# EasyEDA Pro project ProPrj_GTStoppuhr_v0.1.epro

# Schematic Schematic1
Board Name: Board1; Create Date: 2025-01-04; Page Name: P1; Project Name: GravitraxStoppuhr; Schematic Name: Schematic1; Update Date: 2025-01-04; Company: EasyEDA.com; Page Size: A4; Version: V1.0
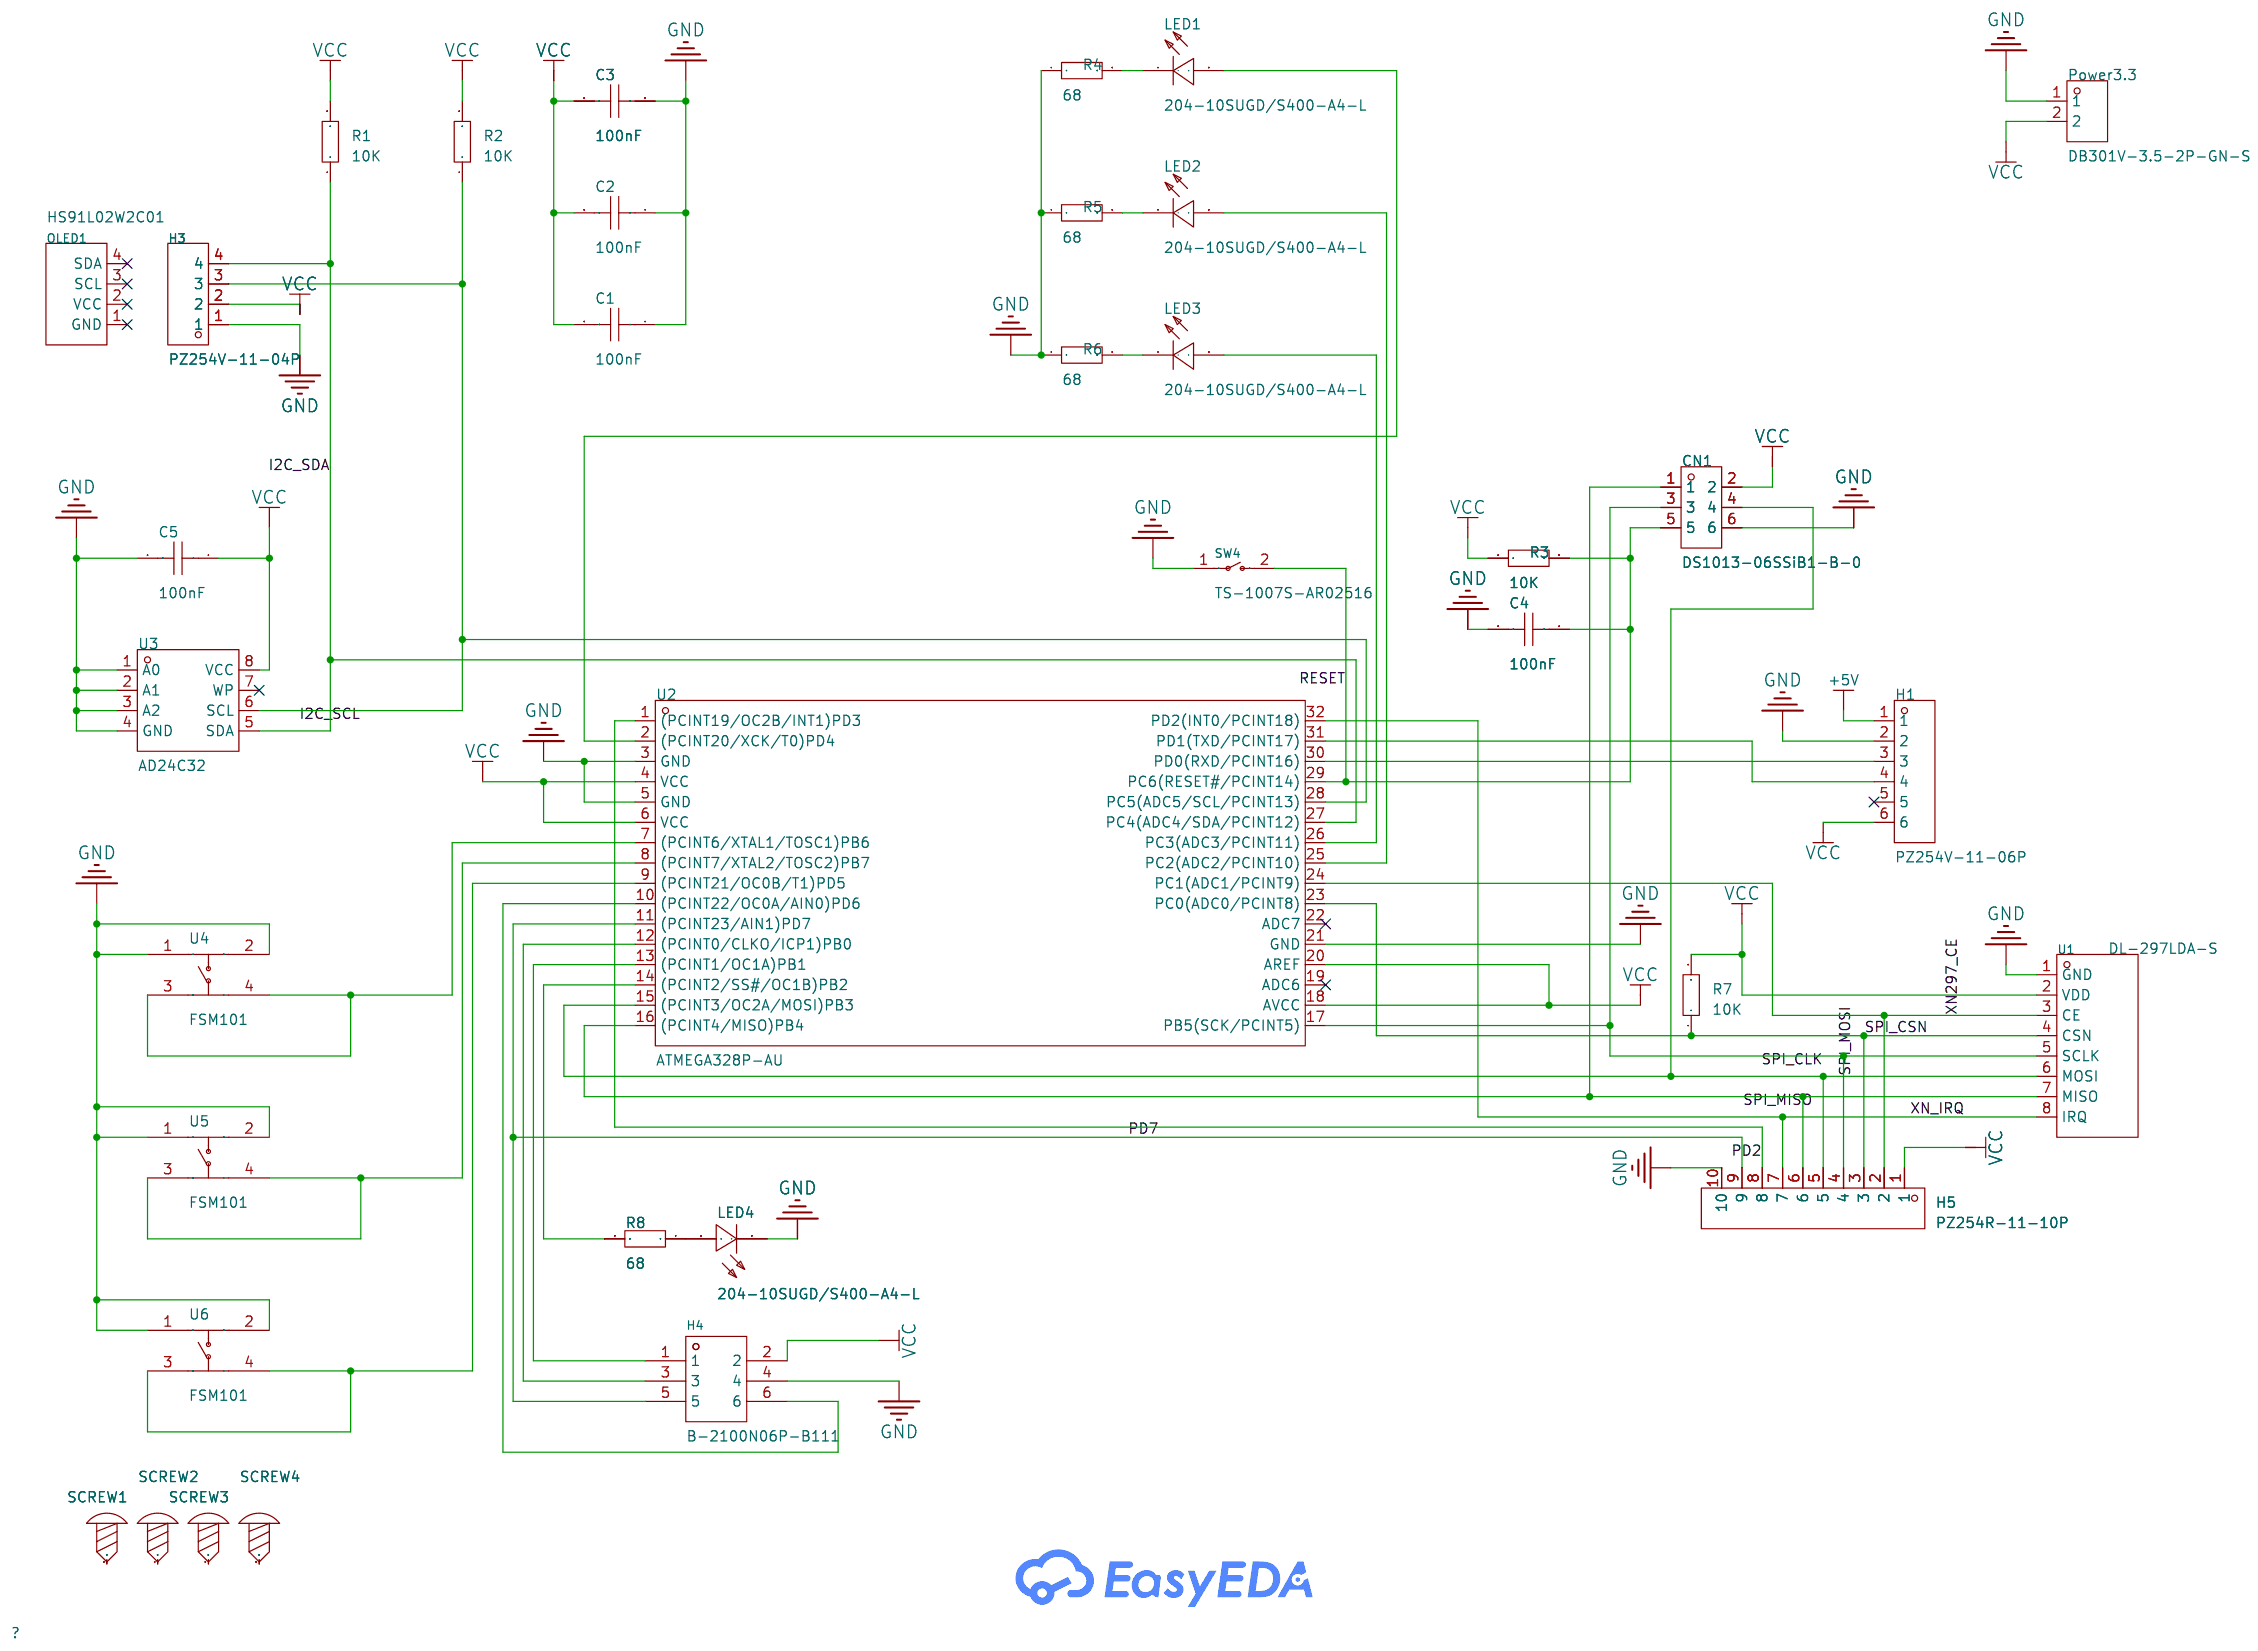
[diagram p0: schematic sheet]

## Parts
C1  100nF  [C0805]
C2  100nF  [C0805]
C3  100nF  [C0805]
C4  100nF  [C1206]
C5  100nF  [C0805]
CN1  DS1013-06SSiB1-B-0  [IDC-TH_6P-P2.54_DS1013-06SSIB1-B-0]
H1  PZ254V-11-06P  [HDR-TH_6P-P2.54-V-M]
H3  PZ254V-11-04P  [HDR-TH_4P-P2.54-V-M]
H4  B-2100N06P-B111  [HDR-SMD_6P-P2.54-V-M-R2-C3-S2.54-LS7.3]
H5  PZ254R-11-10P  [HDR-TH_10P-P2.54-H-M-W10.4]
LED1  204-10SUGD/S400-A4-L  [LED-TH_BD3.9-P2.54-RD]
LED2  204-10SUGD/S400-A4-L  [LED-TH_BD3.9-P2.54-RD]
LED3  204-10SUGD/S400-A4-L  [LED-TH_BD3.9-P2.54-RD]
LED4  204-10SUGD/S400-A4-L  [LED-TH_BD3.9-P2.54-RD]
OLED1  HS91L02W2C01  [OLED-TH_L38.0-W12.0_HS91L02W2C01]
Power3.3  DB301V-3.5-2P-GN-S  [CONN-TH_DB301V-3.5-2P-GN]
R1  10K  [R1206]
R2  10K  [R1206]
R3  10K  [R1206]
R4  68  [R1206]
R5  68  [R1206]
R6  68  [R1206]
R7  10K  [R1206]
R8  68  [R1206]
SCREW1  -  [Screw-Hole-M4]
SCREW2  -  [Screw-Hole-M4]
SCREW3  -  [Screw-Hole-M4]
SCREW4  -  [Screw-Hole-M4]
SW4  TS-1007S-AR02516  [SW-SMD_L6.1-W3.6-LS7.9]
U1  DL-297LDA-S  [WIRELM-SMD_DL-297LDA-S]
U2  ATMEGA328P-AU  [TQFP-32_L7.0-W7.0-P0.80-LS9.0-BL]
U3  AD24C32  [TSSOP-8_L4.4-W3.0-P0.65-LS6.4-BL-3]
U4  FSM101  [SW-TH_4P-L12.0-W12.0-P5.00-LS12.5]
U5  FSM101  [SW-TH_4P-L12.0-W12.0-P5.00-LS12.5]
U6  FSM101  [SW-TH_4P-L12.0-W12.0-P5.00-LS12.5]

## Library data of the parts
C1-C5 = CAP_0603: Supplier Footprint: 0603
CN1 = DS1013-06SSiB1-B-0: Connector Type:Simple cow constellation Pitch:2.54mm Structure:2x3P Holder Type:Direct Insert Number of Rows:2 Pin Number in each Row:3; LCSC Part Name: 2.54mm 2x3P 排数:2 每排P数:3; Supplier Part: C7430309; Manufacturer: CONNFLY; Supplier Footprint: 插件,P=2.54mm; JLCPCB Part Class: Extended Part; Datasheet: https://atta.szlcsc.com/upload/public/pdf/source/20240724/27F7346E828A07242999055B29F019B2.pdf; Supplier: LCSC; Connector Type: Simple cow constellation; Pitch: 2.54mm; Structure: 2x3P; Holder Type: Direct Insert; Number of Rows: 2; Pin Number in each Row: 3
H1 = PZ254V-11-06P: Pin Structure:1x6P Pitch:2.54mm Row Spacing:- Circluar Pins/Square Pins:Square Pins Mounting Type:Straight Number of Rows:Plugin Number of Pins:6P Current Rating (Max):- Voltage Rating (Max):- Length of Mating Pin:6mm Insulation Height:2.5mm Length of End; LCSC Part Name: 间距:2.54mm 1x6P 直插 方针; Supplier Part: C492405; Manufacturer: XFCN(兴飞); Supplier Footprint: 插件,P=2.54mm; JLCPCB Part Class: Extended Part; Datasheet: https://atta.szlcsc.com/upload/public/pdf/source/20200309/C492405_597F1930F5B55CC3C7FD95458F1C3977.pdf; Supplier: LCSC; Pin Structure: 1x6P; Pitch: 2.54mm; Circluar Pins/Square Pins: Square Pins; Mounting Type: Straight; Number of Rows: Plugin; Number of Pins: 6P; Length of Mating Pin: 6mm; Insulation Height: 2.5mm; Length of End Connection Pin: 3mm; Operating Temperature Range: -40℃~+105℃; Color: Black
H3 = PZ254V-11-04P: Pin Structure:1x4P Pitch:2.54mm Row Spacing:- Circluar Pins/Square Pins:Square Pins Mounting Type:Straight Number of Rows:Plugin Number of Pins:4P Current Rating (Max):3A Voltage Rating (Max):250V Length of Mating Pin:6mm Insulation Height:2.5mm Length of; LCSC Part Name: 间距:2.54mm 1x4P 直插 方针; Supplier Part: C2691448; Manufacturer: XFCN(兴飞); Supplier Footprint: 插件,P=2.54mm; JLCPCB Part Class: Extended Part; Datasheet: https://atta.szlcsc.com/upload/public/pdf/source/20200309/C492403_F9F19131791D08044AD4F84F8E751A34.pdf; Supplier: LCSC; Pin Structure: 1x4P; Pitch: 2.54mm; Circluar Pins/Square Pins: Square Pins; Mounting Type: Straight; Number of Rows: Plugin; Number of Pins: 4P; Current Rating (Max): 3A; Voltage Rating (Max): 250V; Length of Mating Pin: 6mm; Insulation Height: 2.5mm; Length of End Connection Pin: 3mm; Operating Temperature Range: -40℃~+105℃; Color: Black
H4 = B-2100N06P-B111: Pin Structure:2x3P Pitch:2.54mm Row Spacing:2.54mm Circluar Pins/Square Pins:Square Pins Mounting Type:Brick nogging Number of Rows:双排 Number of Pins:6P Current Rating (Max):- Voltage Rating (Max):- Length of Mating Pin:6mm Insulation Height:2mm Length of; LCSC Part Name: 间距:2.54mm 2x3P 立贴 方针; Supplier Part: C124390; Manufacturer: Ckmtw(灿科盟); Supplier Footprint: SMD,P=2.54mm; JLCPCB Part Class: Extended Part; Datasheet: https://atta.szlcsc.com/upload/public/pdf/source/20170821/C124391_1503303314915901545.pdf; Supplier: LCSC; Pin Structure: 2x3P; Pitch: 2.54mm; Row Spacing: 2.54mm; Circluar Pins/Square Pins: Square Pins; Mounting Type: Brick nogging; Number of Rows: 双排; Number of Pins: 6P; Length of Mating Pin: 6mm; Insulation Height: 2mm; Operating Temperature Range: -40℃~+105℃; Color: Black
H5 = PZ254R-11-10P: Pin Structure:1x10P Pitch:2.54mm Row Spacing:- Circluar Pins/Square Pins:Square Pins Mounting Type:Right-Angle Number of Rows:Plugin Number of Pins:10P Current Rating (Max):- Voltage Rating (Max):- Length of Mating Pin:6mm Insulation Height:2.5mm Contact; LCSC Part Name: 间距:2.54mm 1x10P 弯插 方针; Supplier Part: C492418; Manufacturer: XFCN(兴飞); Supplier Footprint: 弯插,P=2.54mm; JLCPCB Part Class: Extended Part; Datasheet: https://atta.szlcsc.com/upload/public/pdf/source/20200309/C492418_7D4B377DA52397FDD3F1E8B8860933B9.pdf; Supplier: LCSC; Pin Structure: 1x10P; Pitch: 2.54mm; Circluar Pins/Square Pins: Square Pins; Mounting Type: Right-Angle; Number of Rows: Plugin; Number of Pins: 10P; Length of Mating Pin: 6mm; Insulation Height: 2.5mm; Operating Temperature Range: -40℃~+105℃; Color: Black
LED1-LED4 = 204-10SUGD/S400-A4-L: Supplier Part: C778892; Manufacturer: EVERLIGHT(亿光); Supplier Footprint: 插件; JLCPCB Part Class: Extended Part; Supplier: LCSC
OLED1 = HS91L02W2C01: Main Control Chip:SSD1306 Interface Type:I2C Size:0.91 Pixel Resolution:128x32 Operating Temperature:-40℃~+70℃ Operating Temperature:-40℃~+70℃; LCSC Part Name: 0.91寸OLED显示屏白光IIC; Supplier Part: C5248081; Manufacturer: HS(汉昇); JLCPCB Part Class: Extended Part; Datasheet: https://atta.szlcsc.com/upload/public/pdf/source/20230727/C3E43C8E3DDA847F5681FEE7D95C153D.pdf; Supplier: LCSC; Main Control Chip: SSD1306; Interface Type: I2C; Size: 0.91; Pixel Resolution: 128x32; Operating Temperature: -40℃~+70℃
Power3.3 = DB301V-3.5-2P-GN-S: Structure:1x2P Pitch:3.5mm Color:Green Mounting Style:Straight Current Rating (Max):10A Voltage Rating (Max):130V Number of Pins:2P Number of Rows:1 Wire Gauge - AWG:18~24 Wire Gauge - AWG:18~24 Wire Gauge - mm2:0.5~1 Wire Gauge - mm2:0.5~1 Number of PINs; LCSC Part Name: 3.5mm 1x2P 排数:1 每排P数:2 直插; Supplier Part: C695629; Manufacturer: DORABO(地博电气); Supplier Footprint: 插件,P=3.5mm; JLCPCB Part Class: Extended Part; Datasheet: https://atta.szlcsc.com/upload/public/pdf/source/20230106/1B95616A85A883CA085E21635C8A8490.pdf; Supplier: LCSC; Structure: 1x2P; Pitch: 3.5mm; Color: Green; Mounting Style: Straight; Current Rating (Max): 10A; Voltage Rating (Max): 130V; Number of Pins: 2P; Number of Rows: 1; Wire Gauge - AWG: 18~24; Wire Gauge - mm2: 0.5~1; Number of PINs Per Row: 2; Operating Temperature Range: -40℃~+105℃
R1-R8 = Res_0603: Supplier Footprint: 0603
SCREW1-SCREW4 = Screw-Hole-M4: Supplier Footprint: 插件
SW4 = TS-1007S-AR02516: Circuit:SPST Actuator Style:Rectangle button Operating Force:160gf Mounting Style:Brick nogging Switch Length:6.1mm Switch Width:3.7mm Switch Height:2.5mm Strike Gundam:不带 Contact Current:50mA Voltage Rating (DC):12V Insulation Resistance:100MΩ Actuator/C; LCSC Part Name: 6.1*3.7*2.5mm 立贴 轻触开关; Supplier Part: C720381; Manufacturer: XUNPU(讯普); Supplier Footprint: SMD; JLCPCB Part Class: Extended Part; Datasheet: https://atta.szlcsc.com/upload/public/pdf/source/20200812/C720381_7D5C1A68D18F0196EF37FF8AC1146778.pdf; Supplier: LCSC; Circuit: SPST; Actuator Style: Rectangle button; Operating Force: 160gf; Mounting Style: Brick nogging; Switch Length: 6.1mm; Switch Width: 3.7mm; Switch Height: 2.5mm; Strike Gundam: 不带; Contact Current: 50mA; Voltage Rating (DC): 12V; Insulation Resistance: 100MΩ; Actuator/Cap Color: Gray; Pin Style: Gull Wing; Mechanical Life: 5万次; Operating Temperature: -30℃~+80℃
U1 = DL-297LDA-S: LCSC Part Name: 2.4g模块无线模块接收发射; Supplier Part: C2837201; Manufacturer: DreamLNK(骏晔科技); Supplier Footprint: SMD; JLCPCB Part Class: Extended Part; Datasheet: https://atta.szlcsc.com/upload/public/pdf/source/20210617/C2837201_570735521B38E6A2F19BE7521136B45C.pdf; Supplier: LCSC
U2 = ATMEGA328P-AU_C14877: CPU Core:AVR Program Storage Size:32KB RAM Size:2KB GPIO Ports Number:23 Operating Voltage Range:1.8V~5.5V Operating Voltage Range:1.8V~5.5V CPU Maximum Speed:20MHz Program Memory Type:FLASH EEPROM:1KB Operating Temperature Range:-40℃~+85℃ Operating Tempe; LCSC Part Name: 基于AVR增强型RISC架构的低功耗CMOS 8位微控制器; Supplier Part: C14877; Manufacturer: MICROCHIP(美国微芯); Supplier Footprint: TQFP-32(7x7); JLCPCB Part Class: Extended Part; Datasheet: https://atta.szlcsc.com/upload/public/pdf/source/20140621/1457707095197.pdf; Supplier: LCSC; CPU Core: AVR; Program Storage Size: 32KB; RAM Size: 2KB; GPIO Ports Number: 23; Operating Voltage Range: 1.8V~5.5V; CPU Maximum Speed: 20MHz; Program Memory Type: FLASH; EEPROM: 1KB; Operating Temperature Range: -40℃~+85℃; ADC (Bit): 10bit; Peripheral/Function: WDT；PWM；WDT；PWM; Watchdog: 有; Low-Voltage Detect: 有; Internal Oscillator: 有
U3 = AD24C32: LCSC Part Name: AD24C32串行电可擦除编程只读存储器; Supplier Part: C5125084; Manufacturer: IDCHIP(英锐芯); Supplier Footprint: SOP-8; JLCPCB Part Class: Extended Part; Datasheet: https://atta.szlcsc.com/upload/public/pdf/source/20220829/6CBBEA77791E2F8788A705B689BDBCE3.pdf; Supplier: LCSC
U4-U6 = FSM101: Circuit:SPST - normally open Actuator Style:Round Button Operating Force:160gf Mounting Style:Direct Insert Contact Current:50mA Voltage Rating (DC):24V Pin Style:PCPin Operating Temperature:-35℃~+85℃ Operating Temperature:-35℃~+85℃; Supplier Part: C5340381; Manufacturer: TE Connectivity(泰科电子); Supplier Footprint: DIP,12x12mm; JLCPCB Part Class: Extended Part; Datasheet: https://atta.szlcsc.com/upload/public/pdf/source/20210514/C592923_B94202CB5993ABE6D458CA03B488B113.pdf; Supplier: LCSC; Circuit: SPST - normally open; Actuator Style: Round Button; Operating Force: 160gf; Mounting Style: Direct Insert; Contact Current: 50mA; Voltage Rating (DC): 24V; Pin Style: PCPin; Operating Temperature: -35℃~+85℃

## Nets
+5V: H1.1
GND: C1.1 C2.1 C3.2 C4.2 C5.2 CN1.6 H1.2 H3.1 H4.4 H5.10 LED4.1(-) Power3.3.1 R4.1 R5.1 R6.1 SW4.1 U1.1(GND) U2.3(GND) U2.5(GND) U2.21(GND) U3.1(A0) U3.2(A1) U3.3(A2) U3.4(GND) U4.1 U4.2 U5.1 U5.2 U6.1 U6.2
VCC: C1.2 C2.2 C3.1 C5.1 CN1.2 H1.6 H3.2 H4.2 H5.1 Power3.3.2 R1.2 R2.2 R3.1 R7.2 U1.2(VDD) U2.4(VCC) U2.6(VCC) U2.18(AVCC) U2.20(AREF) U3.8(VCC)
I2C_SCL: H3.3 R2.1 U2.28(PC5(ADC5/SCL/PCINT13)) U3.6(SCL)
I2C_SDA: H3.4 R1.1 U2.27(PC4(ADC4/SDA/PCINT12)) U3.5(SDA)
PD2: H5.8 U2.1((PCINT19/OC2B/INT1)PD3)
PD7: H4.5 H5.9 U2.11((PCINT23/AIN1)PD7)
RESET: C4.1 CN1.5 R3.2 SW4.2 U2.29(PC6(RESET#/PCINT14))
SPI_CLK: CN1.3 H5.4 U1.5(SCLK) U2.17(PB5(SCK/PCINT5))
SPI_CSN: H5.3 R7.1 U1.4(CSN) U2.23(PC0(ADC0/PCINT8))
SPI_MISO: CN1.1 H5.6 U1.7(MISO) U2.16((PCINT4/MISO)PB4)
SPI_MOSI: CN1.4 H5.5 U1.6(MOSI) U2.15((PCINT3/OC2A/MOSI)PB3)
XN297_CE: H5.2 U1.3(CE) U2.24(PC1(ADC1/PCINT9))
XN_IRQ: H5.7 U1.8(IRQ) U2.32(PD2(INT0/PCINT18))
$1N1844: H1.3 U2.30(PD0(RXD/PCINT16))
$1N1848: H1.4 U2.31(PD1(TXD/PCINT17))
$1N2906: LED1.1(-) R4.2
$1N2910: LED2.1(-) R5.2
$1N2915: LED3.1(-) R6.2
$1N3481: LED3.2(+) U2.26(PC3(ADC3/PCINT11))
$1N3487: LED2.2(+) U2.25(PC2(ADC2/PCINT10))
$1N3494: LED1.2(+) U2.2((PCINT20/XCK/T0)PD4)
$1N3868: U2.7((PCINT6/XTAL1/TOSC1)PB6) U4.3 U4.4
$1N3892: U2.8((PCINT7/XTAL2/TOSC2)PB7) U5.3 U5.4
$1N3898: U2.9((PCINT21/OC0B/T1)PD5) U6.3 U6.4
$1N3977: LED4.2(+) R8.1
$1N4659: H4.3 U2.12((PCINT0/CLKO/ICP1)PB0)
$1N4673: H4.6 U2.10((PCINT22/OC0A/AIN0)PD6)
$1N4779: R8.2 U2.14((PCINT2/SS#/OC1B)PB2)
$1N5708: H4.1 U2.13((PCINT1/OC1A)PB1)

Not connected (* = marked no-connect by the designer): H1 5*; OLED1 1(GND)* 2(VCC)* 3(SCL)* 4(SDA)*; SCREW1 1; SCREW2 1; SCREW3 1; SCREW4 1; U2 19(ADC6)* 22(ADC7)*; U3 7(WP)*

# Board PCB1
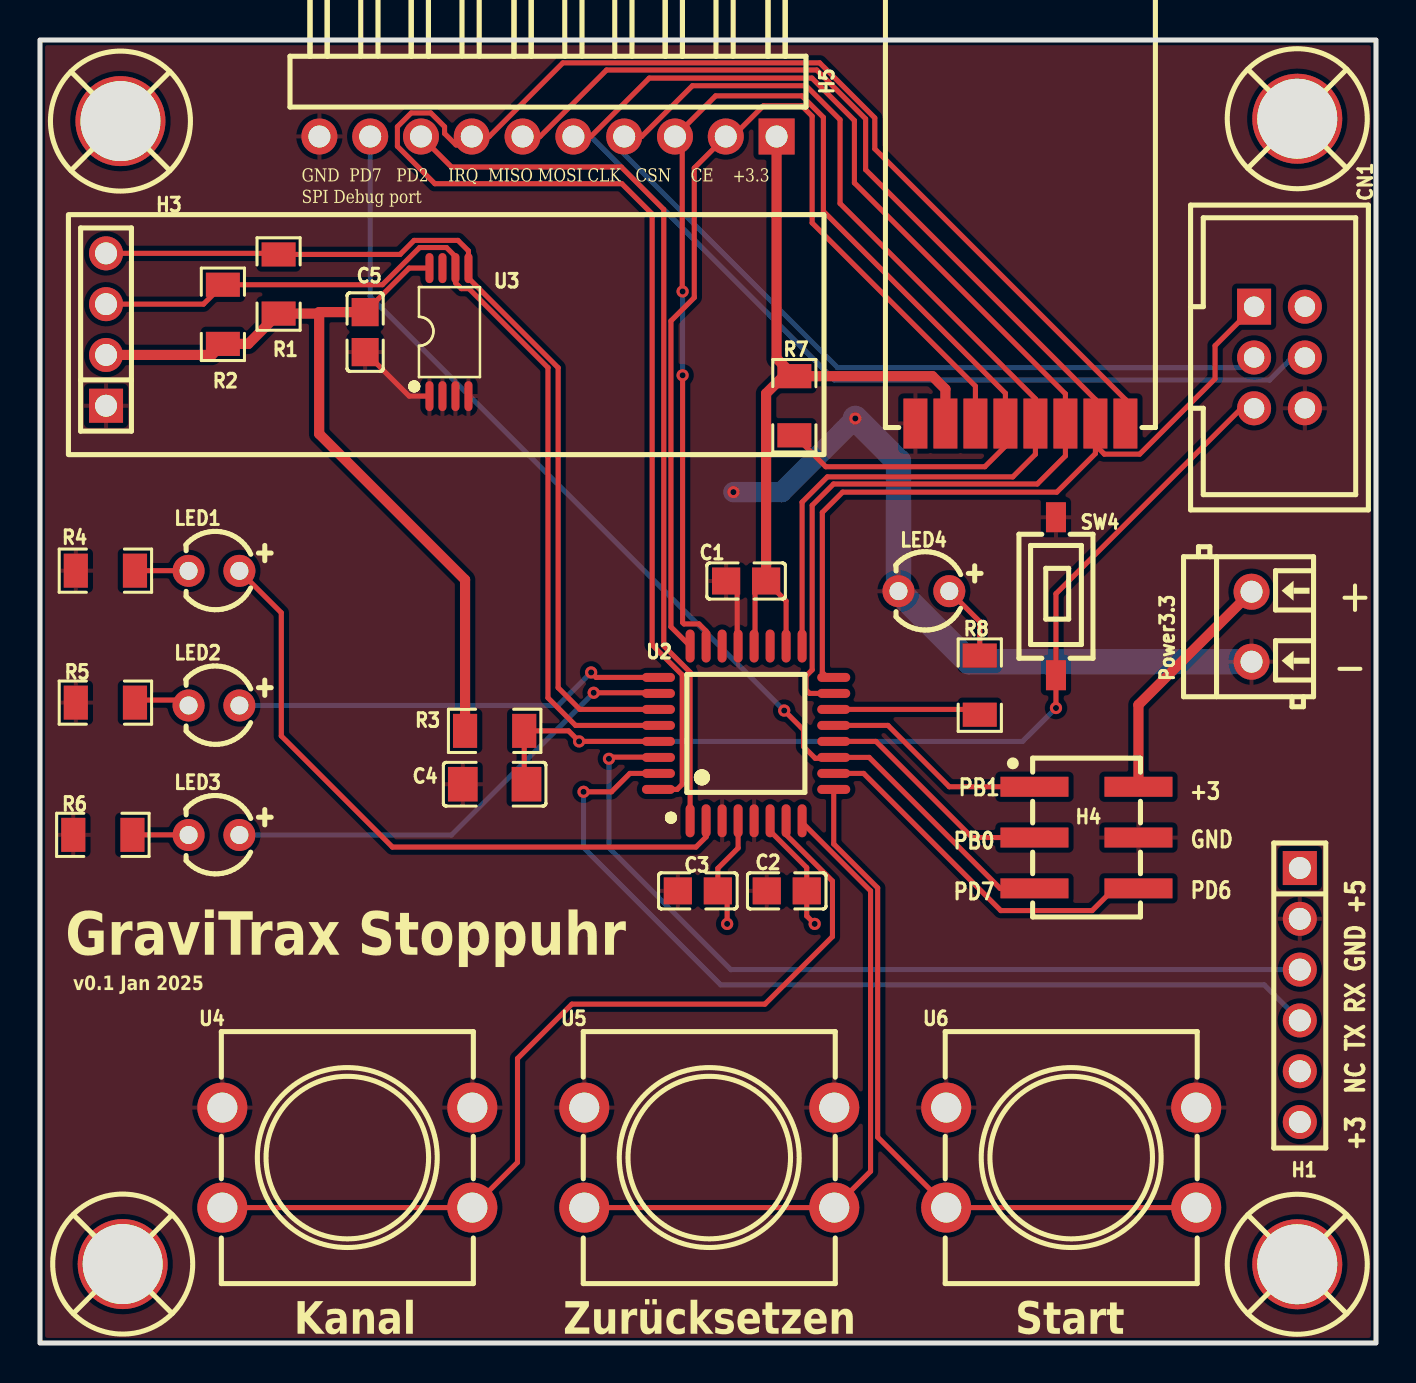
[diagram p1: board, top side]
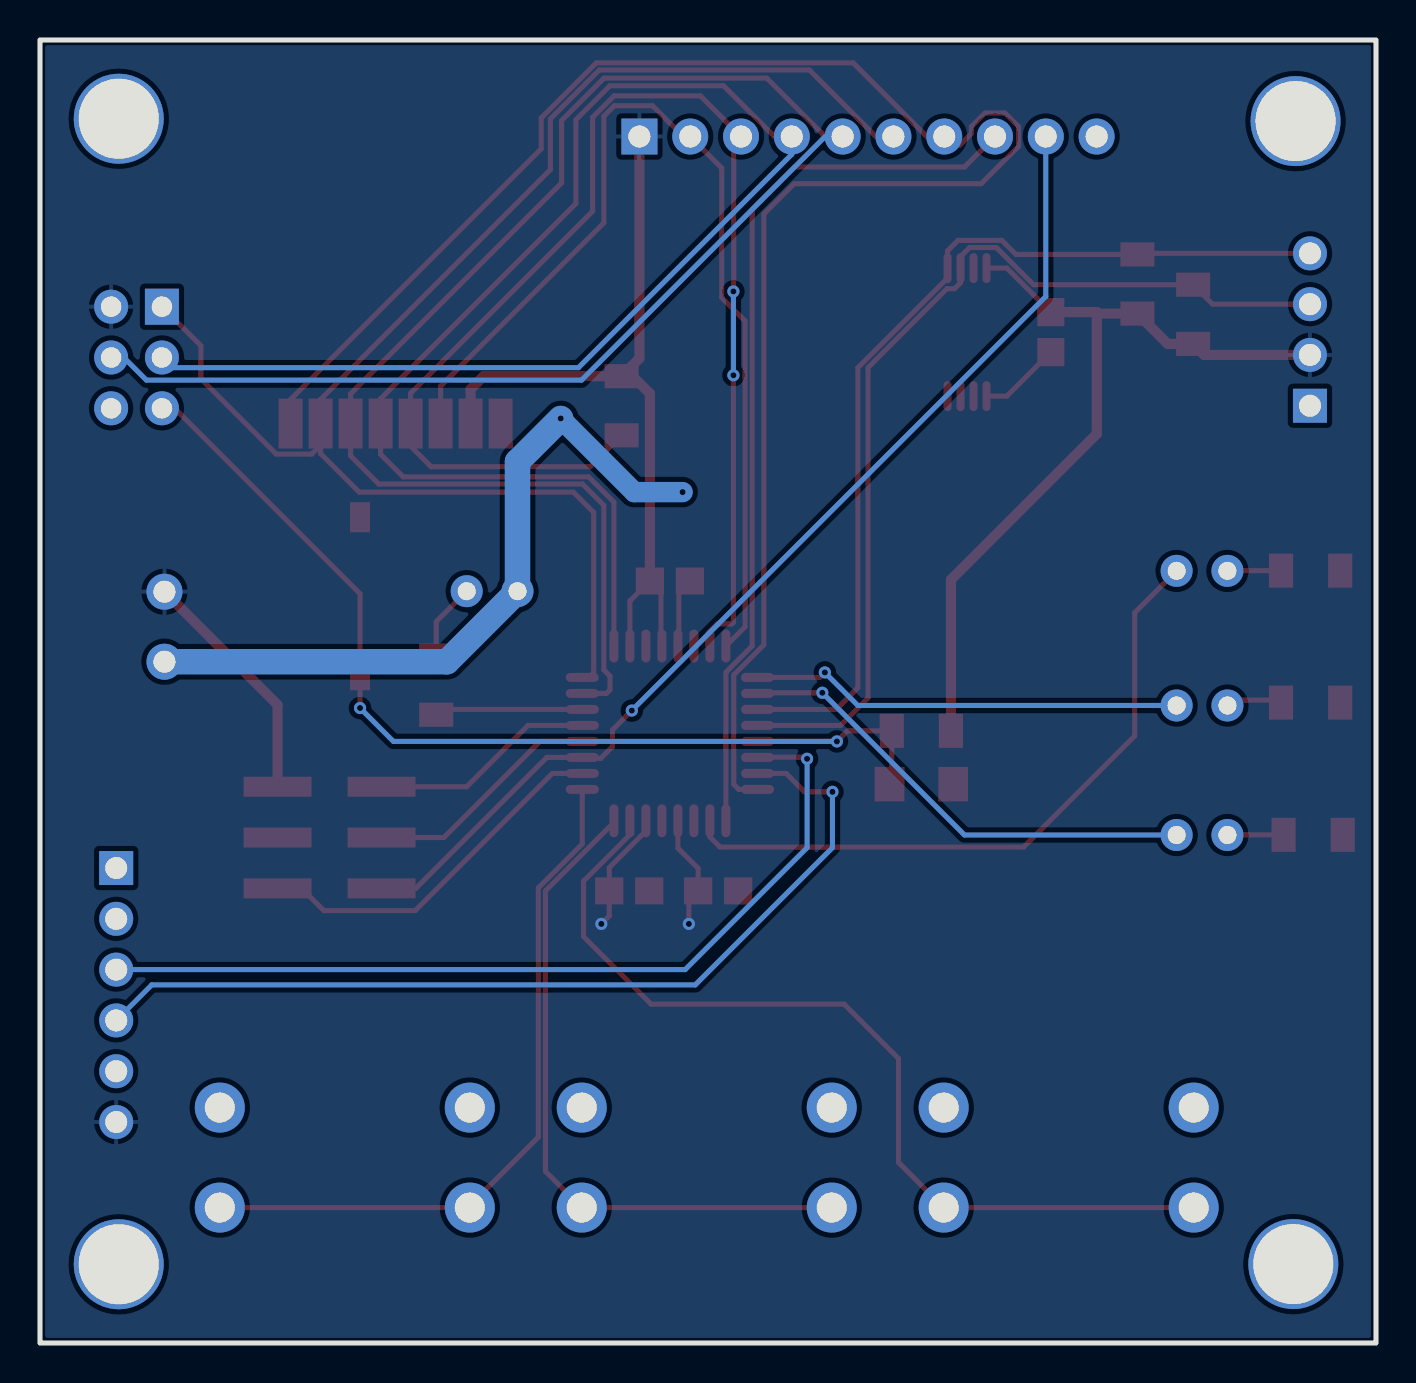
[diagram p2: board, bottom side, seen from below]

Outline 66.8 x 65.15 mm; copper layers: Top Layer, Bottom Layer. Coordinates in mm from the lower left corner of the outline.
Outline path: rectangle 0,65.15 66.8,0
Stack: Top Layer 0.035mm / Dielectric1 1.51mm FR4 er 4.5 / Bottom Layer 0.035mm

## Design rules (mm)
template: JLCPCB Capability(Two Layers Board)
spacing copperThickness1oz (default): track to track 0.102, other pairs 0.152 to 0.3
spacing copperThickness2oz: track to track 0.203, other pairs 0.152 to 0.3
track width copperThickness1oz (default): min 0.127, default 0.254, max 2.54
track width copperThickness2oz: min 0.203, default 0.254, max 2.54
differential pair differentialPair (default): width min 0.127, default 0.254, max 2.54; gap min 0.152, default 0.152
via viaSize (default): diameter min 0.5, default 0.61, max 10; hole min 0.3, default 0.305, max 6.3

## Placement (name value [footprint] x y rotation side)
C1  100nF  [C0805]  35.31 38.1 0 top
C2  100nF  [C0805]  37.34 22.61 0 top
C3  100nF  [C0805]  32.89 22.61 180 top
C4  100nF  [C1206]  22.73 27.94 180 top
C5  100nF  [C0805]  16.26 50.55 270 top
CN1  DS1013-06SSiB1-B-0  [IDC-TH_6P-P2.54_DS1013-06SSIB1-B-0]  61.98 49.28 270 top
H1  PZ254V-11-06P  [HDR-TH_6P-P2.54-V-M]  62.99 17.4 270 top
H3  PZ254V-11-04P  [HDR-TH_4P-P2.54-V-M]  3.3 50.67 90 top
H4  B-2100N06P-B111  [HDR-SMD_6P-P2.54-V-M-R2-C3-S2.54-LS7.3]  52.32 25.27 270 top
H5  PZ254R-11-10P  [HDR-TH_10P-P2.54-H-M-W10.4]  25.4 60.33 180 top
LED1  204-10SUGD/S400-A4-L  [LED-TH_BD3.9-P2.54-RD]  8.7 38.61 0 top
LED2  204-10SUGD/S400-A4-L  [LED-TH_BD3.9-P2.54-RD]  8.7 31.88 0 top
LED3  204-10SUGD/S400-A4-L  [LED-TH_BD3.9-P2.54-RD]  8.7 25.4 0 top
LED4  204-10SUGD/S400-A4-L  [LED-TH_BD3.9-P2.54-RD]  44.2 37.59 0 top
Power3.3  DB301V-3.5-2P-GN-S  [CONN-TH_DB301V-3.5-2P-GN]  60.58 35.81 90 top
R1  10K  [R1206]  11.93 52.95 270 top
R2  10K  [R1206]  9.14 51.44 270 top
R3  10K  [R1206]  22.73 30.61 0 top
R4  68  [R1206]  3.27 38.62 0 top
R5  68  [R1206]  3.27 32.02 0 top
R6  68  [R1206]  3.14 25.41 0 top
R7  10K  [R1206]  37.72 46.86 90 top
R8  68  [R1206]  46.99 32.89 270 top
SCREW1  -  [Screw-Hole-M4]  4.13 3.95 0 top
SCREW2  -  [Screw-Hole-M4]  62.86 3.94 0 top
SCREW3  -  [Screw-Hole-M4]  4.02 61.1 0 top
SCREW4  -  [Screw-Hole-M4]  62.86 61.21 0 top
SW4  TS-1007S-AR02516  [SW-SMD_L6.1-W3.6-LS7.9]  50.8 37.34 270 top
U1  DL-297LDA-S  [WIRELM-SMD_DL-297LDA-S]  49.02 45.97 0 top
U2  ATMEGA328P-AU  [TQFP-32_L7.0-W7.0-P0.80-LS9.0-BL]  35.31 30.48 0 top
U3  AD24C32  [TSSOP-8_L4.4-W3.0-P0.65-LS6.4-BL-3]  20.45 50.55 0 top
U4  FSM101  [SW-TH_4P-L12.0-W12.0-P5.00-LS12.5]  15.37 9.27 0 top
U5  FSM101  [SW-TH_4P-L12.0-W12.0-P5.00-LS12.5]  33.46 9.27 0 top
U6  FSM101  [SW-TH_4P-L12.0-W12.0-P5.00-LS12.5]  51.56 9.27 0 top

## Footprints (pads in the part's own frame, mm; a bottom-side part is the same pattern mirrored in y, then rotated)
C0805
  rect 1.41x1.35 smd: 1(-1,0) 2(1,0)
C1206
  rect 1.485x1.728 smd: 1(-1.593,0) 2(1.593,0)
CONN-TH_DB301V-3.5-2P-GN
  round 1.8 hole 1.1: 1(-1.75,0) 2(1.75,0)
HDR-SMD_6P-P2.54-V-M-R2-C3-S2.54-LS7.3
  rect 1x3.4 smd: 1(-2.54,-2.6) 2(-2.54,2.6) 3(0,-2.6) 4(0,2.6) 5(2.54,-2.6) 6(2.54,2.6)
HDR-TH_4P-P2.54-V-M
  rect 1.7x1.7 hole 1.1: 1(-3.81,0)
  round 1.7 hole 1.1: 2(-1.27,0) 3(1.27,0) 4(3.81,0)
HDR-TH_6P-P2.54-V-M
  rect 1.7x1.7 hole 1.1: 1(-6.35,0)
  round 1.7 hole 1.1: 2(-3.81,0) 3(-1.27,0) 4(1.27,0) 5(3.81,0) 6(6.35,0)
HDR-TH_10P-P2.54-H-M-W10.4
  rect 1.8x1.8 hole 1.1: 1(-11.43,0)
  round 1.8 hole 1.1: 2(-8.89,0) 3(-6.35,0) 4(-3.81,0) 5(-1.27,0) 6(1.27,0) 7(3.81,0) 8(6.35,0) 9(8.89,0) 10(11.43,0)
IDC-TH_6P-P2.54_DS1013-06SSIB1-B-0
  rect 1.8x1.7 hole 1.02: 1(-2.54,-1.27)
  round 1.7 hole 1.02: 2(-2.54,1.27) 3(0,-1.27) 4(0,1.27) 5(2.54,-1.27) 6(2.54,1.27)
LED-TH_BD3.9-P2.54-RD
  round 1.6 hole 0.9: 1(-1.27,0) 2(1.27,0)
R1206
  rect 1.208x1.701 smd: 1(-1.479,0) 2(1.479,0)
Screw-Hole-M4
  round 4.5 hole 4: 1(0,0)
SW-SMD_L6.1-W3.6-LS7.9
  rect 1.5x1 smd: 1(-3.95,0) 2(3.95,0)
SW-TH_4P-L12.0-W12.0-P5.00-LS12.5
  round 2.5 hole 1.5: 1(-6.25,2.5) 2(6.25,2.5) 3(-6.25,-2.5) 4(6.25,-2.5)
TQFP-32_L7.0-W7.0-P0.80-LS9.0-BL
  oval 0.45x1.65 smd: 1(-2.8,-4.369) 2(-2,-4.369) 3(-1.2,-4.369) 4(-0.4,-4.369) 5(0.4,-4.369) 6(1.2,-4.369) 7(2,-4.369) 8(2.8,-4.369) 17(2.8,4.369) 18(2,4.369) 19(1.2,4.369) 20(0.4,4.369) 21(-0.4,4.369) 22(-1.2,4.369) 23(-2,4.369) 24(-2.8,4.369)
  oval 1.65x0.45 smd: 9(4.381,-2.8) 10(4.381,-2) 11(4.381,-1.2) 12(4.381,-0.4) 13(4.381,0.4) 14(4.381,1.2) 15(4.381,2) 16(4.381,2.8) 25(-4.381,2.8) 26(-4.381,2) 27(-4.381,1.2) 28(-4.381,0.4) 29(-4.381,-0.4) 30(-4.381,-1.2) 31(-4.381,-2) 32(-4.381,-2.8)
TSSOP-8_L4.4-W3.0-P0.65-LS6.4-BL-3
  oval 0.4x1.5 smd: 1(-0.975,-3.2) 2(-0.325,-3.2) 3(0.325,-3.2) 4(0.976,-3.2) 5(0.976,3.2) 6(0.325,3.2) 7(-0.325,3.2) 8(-0.975,3.2)
WIRELM-SMD_DL-297LDA-S
  rect 1.2x2.5 smd: 1(-5.25,0) 2(-3.75,0) 3(-2.25,0) 4(-0.75,0) 5(0.75,0) 6(2.25,0) 7(3.75,0) 8(5.25,0)

## Nets
As in the schematic.

Pads without a net: H1 5; SCREW1 1; SCREW2 1; SCREW3 1; SCREW4 1; U2 19 22; U3 7

## Via types
v1: diameter 0.61, hole 0.305, Top Layer to Bottom Layer, 13 vias

## Routing (per net, layer and track width the routed paths; a pad name or vN(x,y) marks a point on that pad's centre or on a via; arc(x,y) is an arc through that point)
GND: length 43.8
  Top Layer w0.254: 34.61,38.1 34.86,37.85 34.86,34.89 U2.21 ; C5.2 18.46,47.35 U3.1
  Bottom Layer w1.016: v1(40.77,46.23) 37.08,42.55 v1(34.67,42.55)
  Bottom Layer w1.27: Power3.3.1 46.45,34.06 42.93,37.59 42.93,44.07 v1(40.77,46.23)
VCC: length 105.4
  Top Layer w0.254: U2.18 37.31,37.1 C1.2 ; U2.6 36.51,25.6 38.34,23.77 C2.2 38.34,21.35 v1(38.73,20.95) ; C5.1 18.46,53.75 U3.8 ; 35.75,37.85 35.75,34.89 U2.20 ; v1(34.36,20.95) 34.36,22.14 C3.1 33.89,23.73 34.91,24.75 U2.4
  Top Layer w0.508: 37.45,48.62 R7.2 44.62,48.34 45.27,47.69 U1.2 ; 37.45,48.62 36.31,47.48 C1.2 ; 37.45,48.62 36.83,49.23 H5.1 ; 13.96,51.47 R1.2 10.41,49.96 R2.2 8.59,49.4 H3.2 ; 13.96,51.47 13.96,45.46 21.25,38.16 21.25,30.61 ; 13.96,51.47 13.96,51.55 C5.1 ; H4.2 54.92,31.91 Power3.3.2
I2C_SCL: length 49.2
  Top Layer w0.254: H3.3 8.17,51.94 R2.1 17.12,52.91 18.98,54.78 20.32,54.78 20.83,54.27 20.83,53.8 U3.6 20.77,53.01 21.07,52.72 21.45,52.72 25.4,48.77 25.4,32.26 26.78,30.88 U2.28
I2C_SDA: length 47.8
  Top Layer w0.254: U2.27 26.99,31.68 25.91,32.77 25.91,48.76 21.42,53.25 U3.5 21.42,54.61 20.9,55.13 18.71,55.13 18,54.43 R1.1 11.88,54.48 H3.4
PD2: length 44.8
  Top Layer w0.254: U2.1 32.51,33.54 31.19,34.85 31.19,56.68 29.07,58.8 20.57,58.8 H5.8
PD7: length 54
  Top Layer w0.254: v1(37.21,31.62) 38.18,30.66 38.18,29.82 38.76,29.23 39.64,29.23 U2.11 41.46,29.28 48.01,22.73 H4.5
  Bottom Layer w0.254: 16.51,60.33 16.51,52.32 v1(37.21,31.62)
RESET: length 53.6
  Top Layer w0.254: v1(50.8,31.75) SW4.2 50.8,37.47 60.07,46.74 60.71,46.74 ; U2.29 v1(26.96,30.08) 26.43,30.61 R3.2 24.21,28.05 C4.1
  Bottom Layer w0.254: v1(26.96,30.08) 49.13,30.08 v1(50.8,31.75)
SPI_CLK: length 90.2
  Top Layer w0.254: U2.17 38.11,42.04 39.37,43.31 48.64,43.31 49.77,44.44 U1.5 49.77,47.21 40,56.98 40,61.16 38.3,62.87 32.62,62.87 30.08,60.33 H5.4
  Bottom Layer w0.254: H5.4 29.21,59.44 39.88,48.77 60.2,48.77 60.71,49.28
SPI_CSN: length 67.1
  Top Layer w0.254: R7.1 39.29,43.81 47.24,43.81 48.27,44.84 U1.4 48.27,47.49 39.17,56.59 39.17,61.28 38.1,62.36 33.78,62.36 H5.3 32.11,59.96 32.11,52.6 v1(32.13,52.58) ; v1(32.13,48.39) 32.13,36.02 32.2,35.95 32.95,35.95 33.31,35.6 U2.23
  Bottom Layer w0.254: v1(32.13,52.58) v1(32.13,48.39)
SPI_MISO: length 75.6
  Top Layer w0.254: H5.6 25,60.33 28.33,63.65 38.84,63.65 41.28,61.21 41.28,58.67 52.77,47.18 U1.7 ; 60.71,51.82 58.76,49.87 58.76,48.21 54.99,44.45 53.22,44.45 52.77,44.89 52.77,44.47 50.84,42.55 40.13,42.55 39.12,41.53 39.12,33.53 39.36,33.28 U2.16
SPI_MOSI: length 103.9
  Top Layer w0.254: H5.5 27.54,60.33 30.46,63.25 38.6,63.25 40.72,61.12 40.72,58.01 51.27,47.46 U1.6 51.27,44.36 49.87,42.95 39.68,42.95 38.61,41.88 38.61,33.66 38.3,33.35 38.3,32.66 38.48,32.48 U2.15
  Bottom Layer w0.254: CN1.4 62.61,49.28 61.48,48.15 39.72,48.15 27.54,60.33 H5.5
XN297_CE: length 50.9
  Top Layer w0.254: U2.24 31.55,35.81 31.55,51.11 32.71,52.27 32.71,58.75 H5.2 34.64,60.33 36.18,61.87 38.08,61.87 38.61,61.34 38.61,56.01 46.77,47.84 U1.3
XN_IRQ: length 93.9
  Top Layer w0.254: U2.32 31.86,27.68 32.11,27.93 32.11,33.4 30.61,34.91 30.61,56.45 29.09,57.97 19.74,57.97 17.87,59.84 17.87,60.81 18.56,61.5 19.54,61.5 20.23,60.81 20.23,60.48 20.8,59.9 21.17,59.9 H5.7 22.46,60.33 26.15,64.01 38.98,64.01 41.74,61.25 41.74,59.71 54.27,47.18 U1.8
$1N1844: length 44.1
  Top Layer w0.254: v1(28.45,29.21) 28.45,29.28 28.43,29.29 30.91,29.29 U2.30
  Bottom Layer w0.254: H1.3 34.54,18.67 28.45,24.77 v1(28.45,29.21)
$1N1848: length 46.3
  Top Layer w0.254: v1(27.18,27.56) 28.58,27.56 29.5,28.48 U2.31
  Bottom Layer w0.254: H1.4 61.21,17.91 34.04,17.91 27.18,24.77 v1(27.18,27.56)
$1N2906: length 2.3
  Top Layer w0.254: LED1.1 7.42,38.62 5.13,38.62
$1N2910: length 2.4
  Top Layer w0.254: 5.13,32.15 7.16,32.15 LED2.1
$1N2915: length 2.3
  Top Layer w0.254: 5.13,25.41 7.42,25.41 LED3.1
$1N3481: length 23.9
  Top Layer w0.254: U2.26 30.89,32.51 v1(27.69,32.51)
  Bottom Layer w0.254: LED3.2 20.57,25.4 v1(27.69,32.51)
$1N3487: length 21.7
  Top Layer w0.254: v1(27.56,33.53) 27.81,33.28 U2.25
  Bottom Layer w0.254: LED2.2 25.91,31.88 v1(27.56,33.53)
$1N3494: length 33.7
  Top Layer w0.254: LED1.2 12.06,36.51 12.06,30.35 17.62,24.8 32.8,24.8 33.31,25.31 U2.2
$1N3868: length 45.9
  Top Layer w0.254: U4.3 U4.4 23.88,9.03 23.88,14.22 26.6,16.94 36.25,16.94 39.62,20.32 39.62,23.09 37.31,25.41 U2.7
$1N3892: length 34
  Top Layer w0.254: U5.3 U5.4 41.53,8.59 41.53,22.61 38.11,26.03 U2.8
$1N3898: length 35.7
  Top Layer w0.254: U2.9 39.69,24.95 41.89,22.75 41.89,10.29 45.31,6.87 U6.3 U6.4
$1N3977: length 3.9
  Top Layer w0.254: LED4.2 46.99,36.07 R8.1
$1N4659: length 12
  Top Layer w0.254: U2.12 41.8,30.08 46.61,25.27 H4.3
$1N4673: length 18.5
  Top Layer w0.254: U2.10 41.18,28.48 48.04,21.62 52.61,21.62 53.72,22.73 H4.6
$1N4779: length 7.4
  Top Layer w0.254: U2.14 46.72,31.68 R8.2
$1N5708: length 11.3
  Top Layer w0.254: H4.1 45.47,27.81 42.4,30.88 U2.13

## Copper pours and planes (outline as drawn; the poured copper is in the pictures)
GND on Top Layer: 0.25,64.9 66.55,64.9 66.55,0.25 0.25,0.25
VCC on Bottom Layer: 0.25,64.9 66.55,64.9 66.55,0.25 0.25,0.25

## Text on the board
Top Silkscreen Layer: PB0 | PD7 | PB1 | +3 | GND | PD6 | +3  NC TX RX GND +5 | - | + | GND  PD7   PD2    IRQ  MISO MOSI CLK   CSN    CE    +3.3 / SPI Debug port | v0.1 Jan 2025 | Kanal | Zurücksetzen | Start | GraviTrax Stoppuhr
